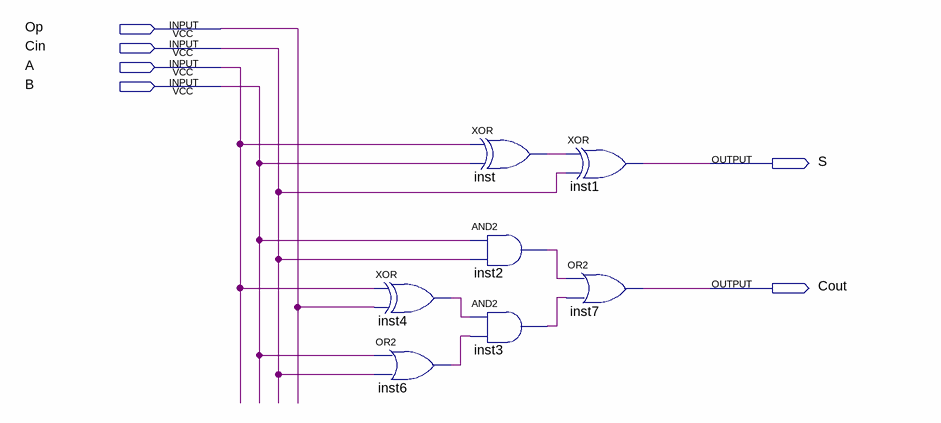
[diagram p0: schematic sheet]
// Quartus schematic somasubParcial.bdf as structural Verilog: 7 symbols, 6 pins
module somasubParcial (
  input  Op,
  input  Cin,
  input  A,
  input  B,
  output S,
  output Cout
);

  wire inst2_out, inst3_out, inst4_out, inst6_out, inst_out;

  xor inst4 (inst4_out, A, Op);
  or inst6 (inst6_out, B, Cin);
  xor inst (inst_out, A, B);
  and inst2 (inst2_out, B, Cin);
  and inst3 (inst3_out, inst4_out, inst6_out);
  xor inst1 (S, inst_out, Cin);
  or inst7 (Cout, inst2_out, inst3_out);
endmodule
